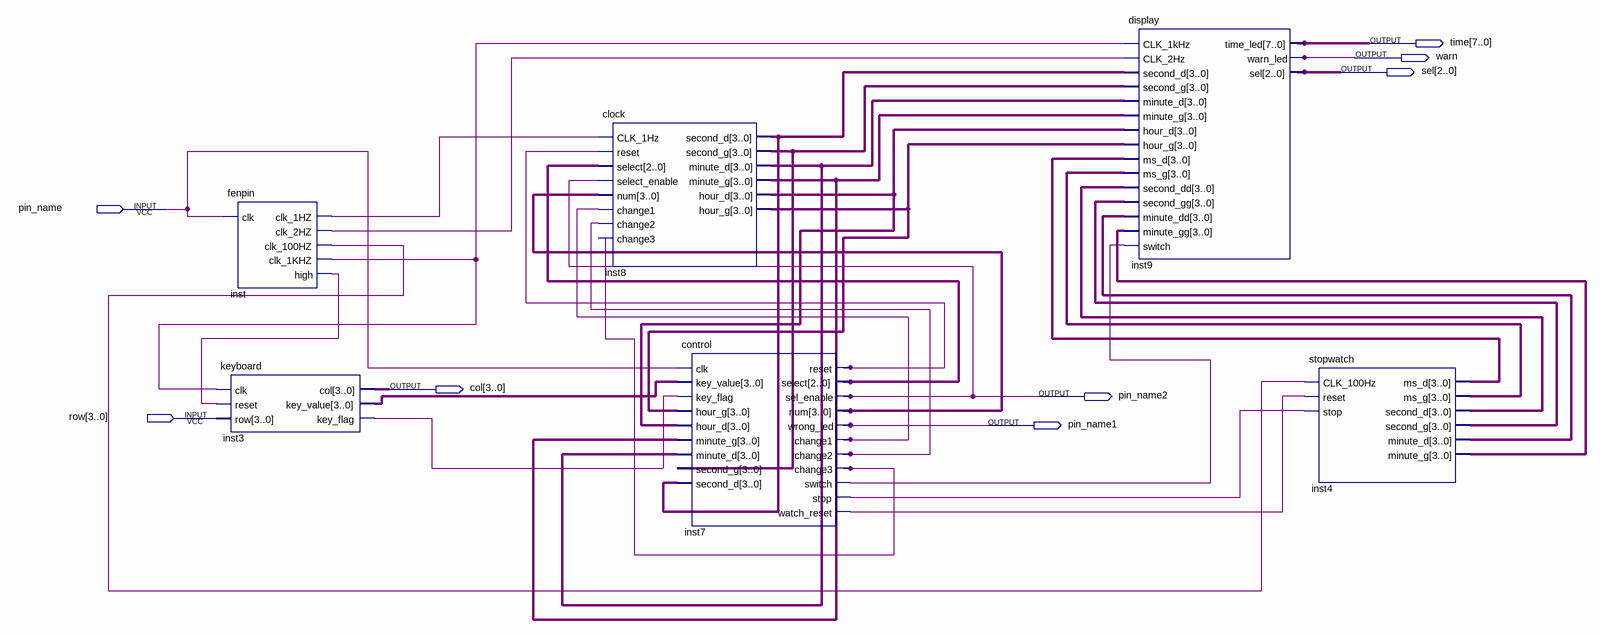
[diagram p0: schematic sheet]
// Quartus schematic myclock.bdf as structural Verilog: 6 symbols, 8 pins
module myclock (
  input  pin_name,
  input  [3:0] row,
  output [7:0] \time ,
  output warn,
  output [2:0] sel,
  output [3:0] col,
  output pin_name2,
  output pin_name1
);

  wire inst3_key_flag, inst7_change1, inst7_change2, inst7_change3, inst7_reset, inst7_stop, inst7_switch,
       inst7_watch_reset, inst_clk_1hz, inst_clk_1khz, inst_clk_2hz, inst_clk_100hz, inst_high;
  wire [2:0] inst7_select;
  wire [3:0] inst3_key_value, inst4_minute_d, inst4_minute_g, inst4_ms_d, inst4_ms_g, inst4_second_d,
       inst4_second_g, inst7_num, inst8_hour_d, inst8_hour_g, inst8_minute_d, inst8_minute_g, inst8_second_d,
       inst8_second_g;

  fenpin inst (
    .clk(pin_name), .clk_1HZ(inst_clk_1hz), .clk_2HZ(inst_clk_2hz), .clk_100HZ(inst_clk_100hz),
    .clk_1KHZ(inst_clk_1khz), .high(inst_high));
  keyboard inst3 (
    .clk(inst_clk_1khz), .reset(inst_high), .row(row), .col(col), .key_value(inst3_key_value),
    .key_flag(inst3_key_flag));
  clock inst8 (
    .CLK_1Hz(inst_clk_1hz), .reset(inst7_reset), .select(inst7_select), .select_enable(pin_name2),
    .num(inst7_num), .change1(inst7_change1), .change2(inst7_change2), .change3(inst7_change3),
    .second_d(inst8_second_d), .second_g(inst8_second_g), .minute_d(inst8_minute_d),
    .minute_g(inst8_minute_g), .hour_d(inst8_hour_d), .hour_g(inst8_hour_g));
  control inst7 (
    .clk(pin_name), .key_value(inst3_key_value), .key_flag(inst3_key_flag), .hour_g(inst8_hour_g),
    .hour_d(inst8_hour_d), .minute_g(inst8_minute_g), .minute_d(inst8_minute_d), .second_g(inst8_second_g),
    .second_d(inst8_second_d), .reset(inst7_reset), .select(inst7_select), .sel_enable(pin_name2),
    .num(inst7_num), .wrong_led(pin_name1), .change1(inst7_change1), .change2(inst7_change2),
    .change3(inst7_change3), .switch(inst7_switch), .stop(inst7_stop), .watch_reset(inst7_watch_reset));
  display inst9 (
    .CLK_1kHz(inst_clk_1khz), .CLK_2Hz(inst_clk_2hz), .second_d(inst8_second_d), .second_g(inst8_second_g),
    .minute_d(inst8_minute_d), .minute_g(inst8_minute_g), .hour_d(inst8_hour_d), .hour_g(inst8_hour_g),
    .ms_d(inst4_ms_d), .ms_g(inst4_ms_g), .second_dd(inst4_second_d), .second_gg(inst4_second_g),
    .minute_dd(inst4_minute_d), .minute_gg(inst4_minute_g), .switch(inst7_switch), .time_led(\time ),
    .warn_led(warn), .sel(sel));
  stopwatch inst4 (
    .CLK_100Hz(inst_clk_100hz), .reset(inst7_watch_reset), .stop(inst7_stop), .ms_d(inst4_ms_d),
    .ms_g(inst4_ms_g), .second_d(inst4_second_d), .second_g(inst4_second_g), .minute_d(inst4_minute_d),
    .minute_g(inst4_minute_g));
endmodule
